# Altium schematic sheet Frontpage.SchDoc: Titel
size A4 portrait; ApprovedBy: name; CompanyName: DCI Electronics bv; DrawnBy: KRS; Address1: Nijverheidsstraat 14; Address2: 4458 AV Eindewege; Address3: Phone: +31 (0)113 344880; DocumentNumber: 0; Revision: 0; SheetNumber: 1; SheetTotal: 5; PageSetup: Record=PageOptions|CenterHorizontal=True|CenterVertical=True|PrintScale=1.00|XCorrection=1.00|YCorrection=1.00|PrintKind=1|BorderSize=5000000|LeftOffset=0|BottomOffset=0|Orientation=2|PaperLength=1000|PaperWidth=1000|Scale=100|PaperSource=7|PrintQuality=-4|MediaType=1|DitherType=10|PaperKind=ISO_A4_(210.00_x_297.00_MM)|PrintScaleMode=1; SubTitle: SubTitel; ApprovedDate: 01-01-12; DesignedBy: KRS
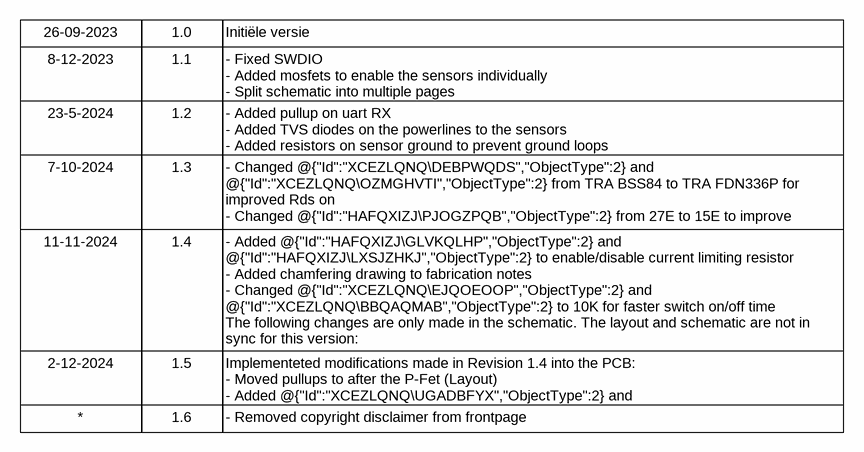
[diagram p0: Frontpage.SchDoc]

## Notes on the sheet
- 26-09-2023
- 1.0
- Initiële versie
- 8-12-2023
- 1.1
- - Fixed SWDIO
  - Added mosfets to enable the sensors individually
  - Split schematic into multiple pages
- 23-5-2024
- 1.2
- - Added pullup on uart RX
  - Added TVS diodes on the powerlines to the sensors
  - Added resistors on sensor ground to prevent ground loops
- 7-10-2024
- 1.3
- - Changed @{"Id":"XCEZLQNQ\DEBPWQDS","ObjectType":2} and @{"Id":"XCEZLQNQ\OZMGHVTI","ObjectType":2} from TRA BSS84 to TRA FDN336P for improved Rds on
  - Changed @{"Id":"HAFQXIZJ\PJOGZPQB","ObjectType":2} from 27E to 15E to improve Vsensor stability
  - Changed ground loop resistors @{"Id":"XCEZLQNQ\VHNZZZWU","ObjectType":2} and @{"Id":"XCEZLQNQ\JQTFWMYG","ObjectType":2} to 0E
  - Changed Vsensor from 3V3 to 3V6
- 11-11-2024
- 1.4
- - Added @{"Id":"HAFQXIZJ\GLVKQLHP","ObjectType":2} and @{"Id":"HAFQXIZJ\LXSJZHKJ","ObjectType":2} to enable/disable current limiting resistor
  - Added chamfering drawing to fabrication notes
  - Changed @{"Id":"XCEZLQNQ\EJQOEOOP","ObjectType":2} and @{"Id":"XCEZLQNQ\BBQAQMAB","ObjectType":2} to 10K for faster switch on/off time
  The following changes are only made in the schematic. The layout and schematic are not in sync for this version:
  - Moved pullups to after the P-Fet (Schematic only)
  - Added @{"Id":"XCEZLQNQ\UGADBFYX","ObjectType":2} and @{"Id":"XCEZLQNQ\RXYZURVO","ObjectType":2} to limit current to MCU IO pin (Schematic only)
- 2-12-2024
- 1.5
- 1.6
- Implementeted modifications made in Revision 1.4 into the PCB:
  - Moved pullups to after the P-Fet (Layout)
  - Added @{"Id":"XCEZLQNQ\UGADBFYX","ObjectType":2} and @{"Id":"XCEZLQNQ\RXYZURVO","ObjectType":2} to limit current to MCU IO pin (Layout)
- - Removed copyright disclaimer from frontpage
- Hardware Documentation
- Project:
- Product:
- Variant:
- Dekimo Goes B.V.
- Nijverheidsstraat 14, 4458 AV  Eindewege, Phone: +31 (0)113 344880
- History Table
- Date
- Revision
- Remarks/Changes